# Altium project USB30HUB2V0.PrjPCB
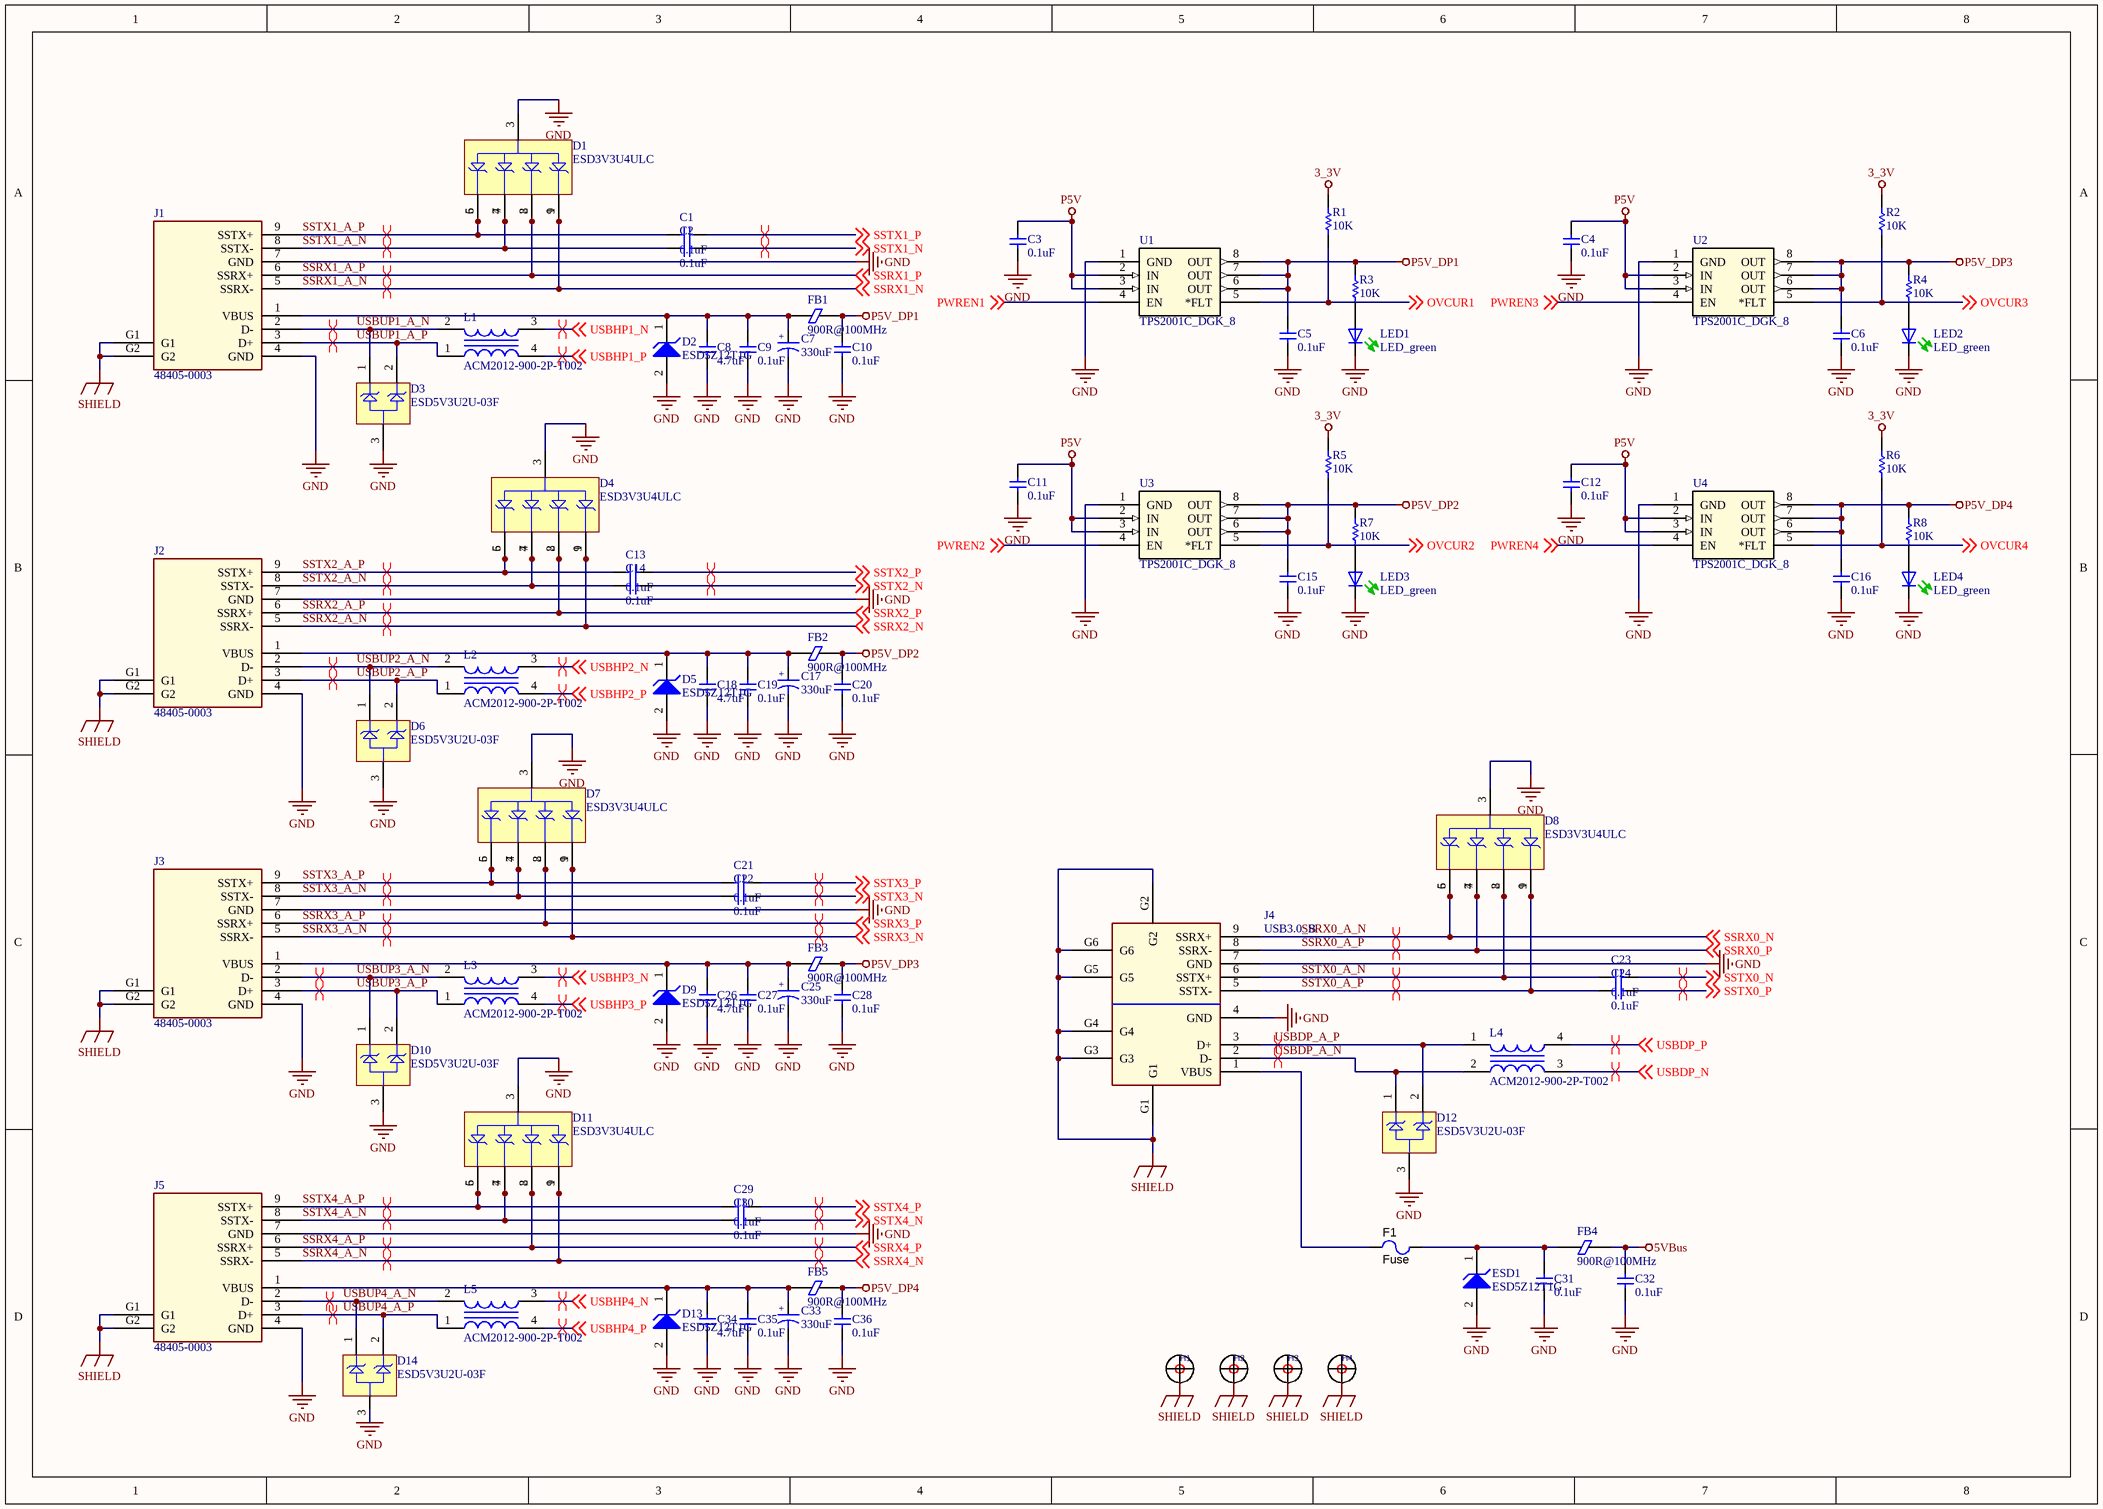
[diagram p0: TUSB8041_Connectors_2.SchDoc]
3 sheets, 193 parts. Net scope: global (net labels, ports and power ports of the same name join across sheets).
Board file: V1_2.PcbDoc
Sheets:
  TUSB8041_Connectors_2.SchDoc
  TUSB8041_Misc_2.SchDoc
  TUSB8041_Power_Logic_2.SchDoc

## Sheet TUSB8041_Connectors_2.SchDoc
size A3; SheetNumber: 1; SheetTotal: 3

### Parts
C1  0.1uF  [CAP0402]
C2  0.1uF  [CAP0402]
C3  0.1uF  [CAP0603]
C4  0.1uF  [CAP0603]
C5  0.1uF  [CAP0603]
C6  0.1uF  [CAP0603]
C7  330uF  [CAP7343_TANT]
C8  4.7uF  [CAP0603]
C9  0.1uF  [CAP0603]
C10  0.1uF  [CAP0603]
C11  0.1uF  [CAP0603]
C12  0.1uF  [CAP0603]
C13  0.1uF  [CAP0402]
C14  0.1uF  [CAP0402]
C15  0.1uF  [CAP0603]
C16  0.1uF  [CAP0603]
C17  330uF  [CAP7343_TANT]
C18  4.7uF  [CAP0603]
C19  0.1uF  [CAP0603]
C20  0.1uF  [CAP0603]
C21  0.1uF  [CAP0402]
C22  0.1uF  [CAP0402]
C23  0.1uF  [CAP0402]
C24  0.1uF  [CAP0402]
C25  330uF  [CAP7343_TANT]
C26  4.7uF  [CAP0603]
C27  0.1uF  [CAP0603]
C28  0.1uF  [CAP0603]
C29  0.1uF  [CAP0402]
C30  0.1uF  [CAP0402]
C31  0.1uF  [CAP0603]
C32  0.1uF  [CAP0603]
C33  330uF  [CAP7343_TANT]
C34  4.7uF  [CAP0603]
C35  0.1uF  [CAP0603]
C36  0.1uF  [CAP0603]
D1  ESD3V3U4ULC  [PG-TSLP-9-1]
D2  ESD5Z12T1G  [ONSC-SOD-523-2-502-01_V]
D3  ESD5V3U2U-03F  [INF-PG-TSFP-3-1_V]
D4  ESD3V3U4ULC  [PG-TSLP-9-1]
D5  ESD5Z12T1G  [ONSC-SOD-523-2-502-01_V]
D6  ESD5V3U2U-03F  [INF-PG-TSFP-3-1_V]
D7  ESD3V3U4ULC  [PG-TSLP-9-1]
D8  ESD3V3U4ULC  [PG-TSLP-9-1]
D9  ESD5Z12T1G  [ONSC-SOD-523-2-502-01_V]
D10  ESD5V3U2U-03F  [INF-PG-TSFP-3-1_V]
D11  ESD3V3U4ULC  [PG-TSLP-9-1]
D12  ESD5V3U2U-03F  [INF-PG-TSFP-3-1_V]
D13  ESD5Z12T1G  [ONSC-SOD-523-2-502-01_V]
D14  ESD5V3U2U-03F  [INF-PG-TSFP-3-1_V]
ESD1  ESD5Z12T1G  [ONSC-SOD-523-2-502-01_V]
F1  Fuse  [FUSE1206]
FB1  900R@100MHz  [L0805]
FB2  900R@100MHz  [L0805]
FB3  900R@100MHz  [L0805]
FB4  900R@100MHz  [L0805]
FB5  900R@100MHz  [L0805]
H1  HOLE  [HOLE_Φ3_1_2D]  (value not drawn)
H2  HOLE  [HOLE_Φ3_1_2D]  (value not drawn)
H3  HOLE  [HOLE_Φ3_1_2D]  (value not drawn)
H4  HOLE  [HOLE_Φ3_1_2D]  (value not drawn)
J1  48405-0003  [CN_USB30_A]
J2  48405-0003  [CN_USB30_A]
J3  48405-0003  [CN_USB30_A]
J4  USB3.0_B  [ASS_4224_CO]
J5  48405-0003  [CN_USB30_A]
L1  ACM2012-900-2P-T002  [TDK-ACM2012_V]
L2  ACM2012-900-2P-T002  [TDK-ACM2012_V]
L3  ACM2012-900-2P-T002  [TDK-ACM2012_V]
L4  ACM2012-900-2P-T002  [TDK-ACM2012_V]
L5  ACM2012-900-2P-T002  [TDK-ACM2012_V]
LED1  LED_green  [LED-0603-GREEN]
LED2  LED_green  [LED-0603-GREEN]
LED3  LED_green  [LED-0603-GREEN]
LED4  LED_green  [LED-0603-GREEN]
R1  10K  [RES0603]
R2  10K  [RES0603]
R3  10K  [RES0603]
R4  10K  [RES0603]
R5  10K  [RES0603]
R6  10K  [RES0603]
R7  10K  [RES0603]
R8  10K  [RES0603]
U1  TPS2001C_DGK_8  [VSSOP8]
U2  TPS2001C_DGK_8  [VSSOP8]
U3  TPS2001C_DGK_8  [VSSOP8]
U4  TPS2001C_DGK_8  [VSSOP8]

### Nets
3_3V: R1.1 R2.1 R5.1 R6.1
5VBus: C32.2 FB4.2
GND: C3.1 C4.1 C5.1 C6.1 C7.2 C8.1 C9.1 C10.1 C11.1 C12.1 C15.1 C16.1 C17.2 C18.1 C19.1 C20.1 C25.2 C26.1 C27.1 C28.1 C31.1 C32.1 C33.2 C34.1 C35.1 C36.1 D1.3(A) D2.2(A) D3.3(A) D4.3(A) D5.2(A) D6.3(A) D7.3(A) D8.3(A) D9.2(A) D10.3(A) D11.3(A) D12.3(A) D13.2(A) D14.3(A) ESD1.2(A) J1.4(GND) J1.7(GND) J2.4(GND) J2.7(GND) J3.4(GND) J3.7(GND) J4.4(GND) J4.7(GND) J5.4(GND) J5.7(GND) LED1.K(C) LED2.K(C) LED3.K(C) LED4.K(C) U1.1(GND) U2.1(GND) U3.1(GND) U4.1(GND)
P5V: C3.2 C4.2 C11.2 C12.2 U1.2(IN) U1.3(IN) U2.2(IN) U2.3(IN) U3.2(IN) U3.3(IN) U4.2(IN) U4.3(IN)
P5V_DP1: C5.2 C10.2 FB1.2 R3.1 U1.6(OUT) U1.7(OUT) U1.8(OUT)
P5V_DP2: C15.2 C20.2 FB2.2 R7.1 U3.6(OUT) U3.7(OUT) U3.8(OUT)
P5V_DP3: C6.2 C28.2 FB3.2 R4.1 U2.6(OUT) U2.7(OUT) U2.8(OUT)
P5V_DP4: C16.2 C36.2 FB5.2 R8.1 U4.6(OUT) U4.7(OUT) U4.8(OUT)
SHIELD: H1.1 H2.1 H3.1 H4.1 J1.G1 J1.G2 J2.G1 J2.G2 J3.G1 J3.G2 J4.G1 J4.G2 J4.G3 J4.G4 J4.G5 J4.G6 J5.G1 J5.G2
OVCUR1: R1.2 U1.5(*FLT) ; off-sheet OVCUR1
OVCUR2: R5.2 U3.5(*FLT) ; off-sheet OVCUR2
OVCUR3: R2.2 U2.5(*FLT) ; off-sheet OVCUR3
OVCUR4: R6.2 U4.5(*FLT) ; off-sheet OVCUR4
PWREN1: U1.4(EN) ; off-sheet PWREN1
PWREN2: U3.4(EN) ; off-sheet PWREN2
PWREN3: U2.4(EN) ; off-sheet PWREN3
PWREN4: U4.4(EN) ; off-sheet PWREN4
SSRX0_A_N: D8.5(K5) D8.6(K6) J4.9(SSRX+) ; off-sheet SSRX0_N  [also labelled SSRX0_N]
SSRX0_A_P: D8.4(K4) D8.7(K7) J4.8(SSRX-) ; off-sheet SSRX0_P  [also labelled SSRX0_P]
SSRX1_A_N: D1.1(K1) D1.9(K9) J1.5(SSRX-) ; off-sheet SSRX1_N  [also labelled SSRX1_N]
SSRX1_A_P: D1.2(K2) D1.8(K8) J1.6(SSRX+) ; off-sheet SSRX1_P  [also labelled SSRX1_P]
SSRX2_A_N: D4.1(K1) D4.9(K9) J2.5(SSRX-) ; off-sheet SSRX2_N  [also labelled SSRX2_N]
SSRX2_A_P: D4.2(K2) D4.8(K8) J2.6(SSRX+) ; off-sheet SSRX2_P  [also labelled SSRX2_P]
SSRX3_A_N: D7.1(K1) D7.9(K9) J3.5(SSRX-) ; off-sheet SSRX3_N  [also labelled SSRX3_N]
SSRX3_A_P: D7.2(K2) D7.8(K8) J3.6(SSRX+) ; off-sheet SSRX3_P  [also labelled SSRX3_P]
SSRX4_A_N: D11.1(K1) D11.9(K9) J5.5(SSRX-) ; off-sheet SSRX4_N  [also labelled SSRX4_N]
SSRX4_A_P: D11.2(K2) D11.8(K8) J5.6(SSRX+) ; off-sheet SSRX4_P  [also labelled SSRX4_P]
SSTX0_A_N: C23.2 D8.2(K2) D8.8(K8) J4.6(SSTX+)
SSTX0_A_P: C24.2 D8.1(K1) D8.9(K9) J4.5(SSTX-)
SSTX0_N: C23.1 ; off-sheet SSTX0_N
SSTX0_P: C24.1 ; off-sheet SSTX0_P
SSTX1_A_N: C2.2 D1.4(K4) D1.7(K7) J1.8(SSTX-)
SSTX1_A_P: C1.2 D1.5(K5) D1.6(K6) J1.9(SSTX+)
SSTX1_N: C2.1 ; off-sheet SSTX1_N
SSTX1_P: C1.1 ; off-sheet SSTX1_P
SSTX2_A_N: C14.2 D4.4(K4) D4.7(K7) J2.8(SSTX-)
SSTX2_A_P: C13.2 D4.5(K5) D4.6(K6) J2.9(SSTX+)
SSTX2_N: C14.1 ; off-sheet SSTX2_N
SSTX2_P: C13.1 ; off-sheet SSTX2_P
SSTX3_A_N: C22.2 D7.4(K4) D7.7(K7) J3.8(SSTX-)
SSTX3_A_P: C21.2 D7.5(K5) D7.6(K6) J3.9(SSTX+)
SSTX3_N: C22.1 ; off-sheet SSTX3_N
SSTX3_P: C21.1 ; off-sheet SSTX3_P
SSTX4_A_N: C30.2 D11.4(K4) D11.7(K7) J5.8(SSTX-)
SSTX4_A_P: C29.2 D11.5(K5) D11.6(K6) J5.9(SSTX+)
SSTX4_N: C30.1 ; off-sheet SSTX4_N
SSTX4_P: C29.1 ; off-sheet SSTX4_P
USBDP_A_N: D12.1(K1) J4.2(D-) L4.2
USBDP_A_P: D12.2(K2) J4.3(D+) L4.1
USBDP_N: L4.3 ; off-sheet USBDP_N
USBDP_P: L4.4 ; off-sheet USBDP_P
USBHP1_N: L1.3 ; off-sheet USBHP1_N
USBHP1_P: L1.4 ; off-sheet USBHP1_P
USBHP2_N: L2.3 ; off-sheet USBHP2_N
USBHP2_P: L2.4 ; off-sheet USBHP2_P
USBHP3_N: L3.3 ; off-sheet USBHP3_N
USBHP3_P: L3.4 ; off-sheet USBHP3_P
USBHP4_N: L5.3 ; off-sheet USBHP4_N
USBHP4_P: L5.4 ; off-sheet USBHP4_P
USBUP1_A_N: D3.1(K1) J1.2(D-) L1.2
USBUP1_A_P: D3.2(K2) J1.3(D+) L1.1
USBUP2_A_N: D6.1(K1) J2.2(D-) L2.2
USBUP2_A_P: D6.2(K2) J2.3(D+) L2.1
USBUP3_A_N: D10.1(K1) J3.2(D-) L3.2
USBUP3_A_P: D10.2(K2) J3.3(D+) L3.1
USBUP4_A_N: D14.1(K1) J5.2(D-) L5.2
USBUP4_A_P: D14.2(K2) J5.3(D+) L5.1
NetC7_1: C7.1 C8.2 C9.2 D2.1(K) FB1.1 J1.1(VBUS)
NetC17_1: C17.1 C18.2 C19.2 D5.1(K) FB2.1 J2.1(VBUS)
NetC25_1: C25.1 C26.2 C27.2 D9.1(K) FB3.1 J3.1(VBUS)
NetC31_2: C31.2 ESD1.1(K) F1.1 FB4.1
NetC33_1: C33.1 C34.2 C35.2 D13.1(K) FB5.1 J5.1(VBUS)
NetF1_2: F1.2 J4.1(VBUS)
NetLED1_A: LED1.A R3.2
NetLED2_A: LED2.A R4.2
NetLED3_A: LED3.A R7.2
NetLED4_A: LED4.A R8.2

### Layout directives
differential pair: SSRX0_A_N, SSRX0_A_P, SSRX1_A_N, SSRX1_A_P, SSRX2_A_N, SSRX2_A_P, SSRX3_A_N, SSRX3_A_P, SSRX4_A_N, SSRX4_A_P, SSTX0_A_N, SSTX0_A_P, SSTX0_N, SSTX0_P, SSTX1_A_N, SSTX1_A_P, SSTX1_N, SSTX1_P, SSTX2_A_N, SSTX2_A_P, SSTX2_N, SSTX2_P, SSTX3_A_N, SSTX3_A_P, SSTX3_N, SSTX3_P, SSTX4_A_N, SSTX4_A_P, SSTX4_N, SSTX4_P, USBDP_A_N, USBDP_A_P, USBDP_N, USBDP_P, USBHP1_N, USBHP1_P, USBHP2_N, USBHP2_P, USBHP3_N, USBHP3_P, USBHP4_N, USBHP4_P, USBUP1_A_N, USBUP1_A_P, USBUP2_A_N, USBUP2_A_P, USBUP3_A_N, USBUP3_A_P, USBUP4_A_N, USBUP4_A_P

### Notes on the sheet
- Title
- Size:
- Date:
- A3
- Number:
- Time:
- Revision:
- Sheet
- of
- File:
- (in symbol CAP_POL) +

### Library data of the parts
C1-C6 C8-C16 C18-C24 C26-C32 C34-C36 = CAP: Capacitor; Value: 104; Published: 8-Jun-2000; LatestRevisionDate: 17-Jul-2002; LatestRevisionNote: Re-released for DXP Platform.; PackageReference: RAD-0.3; Publisher: Altium Limited
C7 C17 C25 C33 = CAP_POL
D1 D4 D7 D8 D11 = ESD3V3U4ULC: Ultra-Low Capacitance ESD / Transient Protection Array, -40 to 125 degC, PG-TSLP-9-1, Reel, Green; Manufacturer: Infineon; VRWM (max): 3.3Â V; CL (typ): 0.4Â pF; CL (max): 0.65Â pF; Rdyn typ reverse: 0.19Â Ohm; IEFT: 50 A; IR (max): 50Â uA; Rdyn typ forward: 0.23Â Ohm; Protected Lines: 4; VESD (max): 20Â kV; Green: TRUE; Isurge: 3 A; PackageVersion: Mar-13; ComponentLink2Description: Datasheet; ComponentLink3Description: Package Specification; ComponentLink1Description: Manufacturer URL; DatasheetVersion: Rev. 1.2; Packing: Reel; PackageDescription: 9-Pin Thin Small Leadless Package, Body 2.3 x 1 mm, Pitch 0.5 mm; PackageReference: PG-TSLP-9-1; ComponentLink2URL: http://www.infineon.com/dgdl/ESD3V3U4ULC_rev_1_2_ESD_Transient_Protection_Diode_Infineon.pdf?folderId=db3a30431f848401011fcbf2ab4c04c4&fileId=db3a30433004641301300d2a08107ac6; ComponentLink3URL: http://www.infineon.com/dgdl/ESD3V3U4ULC_rev_1_2_ESD_Transient_Protection_Diode_Infineon.pdf?folderId=db3a30431f848401011fcbf2ab4c04c4&fileId=db3a30433004641301300d2a08107ac6; ComponentLink1URL: http://www.infineon.com/; Halogen-free: TRUE; PartNumber: ESD3V3U4ULC; Mounting Technology: Surface Mount
D2 D5 D9 D13 ESD1 = CMP-1063-00099-1: Transient Voltage Suppressor, Micro-Packaged Diode for ESD Protection, 2-Pin SOD-523, Pb-Free, Tape and Reel; Manufacturer: On Semiconductor; VRWM Max (V): 12; Number of Lines: 1; V(BR) Min (V): 14.1; Direction: Unidirectional; IR Max (uA): 0.01; PPK Max (W): 240; ComponentLink1URL: http://www.onsemi.com/; PartNumber: ESD5Z12T1G; RoHS: Pb-Free; ComponentLink3Description: Package Specification; PackageVersion: Rev. E, 09/2010; PackageReference: SOD-523-2-502-01; PackageDescription: 2-Pin SOD, Body 1.2 x 0.8 mm; ComponentLink2Description: Datasheet; ComponentLink1Description: Manufacturer URL; Mounting Technology: Surface Mount; DatasheetVersion: Rev. 10; ComponentLink3URL: http://www.onsemi.com/pub_link/Collateral/502-01.PDF; ComponentLink2URL: http://www.onsemi.cn/pub_link/Collateral/ESD5Z2.5T1-D.PDF; Packing: Tape and Reel
D3 D6 D10 D12 D14 = CMP-1150-00002-1: Ultra-Low Capacitance ESD Diode Array, -40 to 125 degC, PG-TSFP-3-1, Reel, Green; Manufacturer: Infineon; Rdyn typ reverse: 0.6Â Ohm; Rdyn typ forward: 0.5Â Ohm; VRWM (max): 5.3Â V; IR (max): 50Â uA; CL (typ): 0.4Â pF; IEFT: 40 A; VESD (max): 20Â kV; Isurge: 3 A; CL (max): 0.6Â pF; Green: TRUE; Protected Lines: 2; ComponentLink3URL: http://www.infineon.com/dgdl/TSFP-3-1%2C-2-Package_Overview.pdf?folderId=db3a30431936bc4b0119538cdcb03d2d&fileId=db3a30431936bc4b0119539929863d46; PartNumber: ESD5V3U2U-03F; ComponentLink3Description: Package Specification; ComponentLink2Description: Datasheet; ComponentLink2URL: http://www.infineon.com/dgdl/esd5v3u2useries.pdf?folderId=db3a30431441fb5d011488a9e66f0ded&fileId=db3a30431b0626df011b0d3e3ca97dc0; PackageReference: PG-TSFP-3-1; ComponentLink1URL: http://www.infineon.com/; Mounting Technology: Surface Mount; ComponentLink1Description: Manufacturer URL; PackageVersion: Apr-08; Halogen-free: TRUE; Packing: Reel; PackageDescription: 3-Pin Thin Small Flat Package, Body 1.2 x 0.8 mm, Pitch 0.4 mm
F1 = Fuse: PartNumber: NANOSMDC020F-2; Manufacturer: TE Connectivity; VDC_V: 24; Rtyp_Ohm: 1.875; SymbolCreator: a0412235; SymbolVersion: 2013-04-02; PackageReference: 1206; MountType: SMT; CompType: Fuse; RoHS: Y; Published: 2009-03-05; Publisher: Texas Instruments; LatestRevisionDate: 2015-11-23; ComponentLink1Description: Datasheet URL; ComponentLink1URL: http://www.te.com/commerce/DocumentDelivery/DDEController?Action=srchrtrv&DocNm=SCD25536&DocType=Customer+Drawing&DocLang=English; Supplier 1: Digi-Key; Supplier Part Number 1: NANOSMDC020F-2CT-ND; Supplier 2: Mouser; Supplier Part Number 2: 650-NANOSMDC020F-2; Supplier 3: Farnell; Supplier Part Number 3: 1345939
FB1-FB5 = Ferrite Bead
H1-H4 = HOLE: CLASS: IC; CAD_APPROVED: Yes; MFG_PN01: TP-105-01-09; MFG_NAME01: COMPONENTS CORPORATION; AGILE_PN: 210-75685; HEIGHT: 4.8 MM; ROHS: Yes
J1-J3 J5 = USB-UEA11123-4HK1-4H: Date: 02042009
L1-L5 = CMP-2000-05738-1: Common Mode Filter, 90 Ohm, 50 V, -40 to 85 degC, 4-Pin SMD, RoHS, Tape and Reel; Manufacturer: TDKCorporation; Test Frequency: 100MHz; Configuration: Dual; Maximum DC Resistance: 190mOhm; Product Depth: 1.4mm; Product Height: 1.3mm; Voltage Rating: 50VDC; Impedance: 90Ohm; Product Length: 2.2mm; Number of Lines: 2; Maximum DC Current: 400mA; Type: SignalLine; Maximum Operating Temperature: 85C; Minimum Operating Temperature: -40C; Part No: ACM2012-900-2P-T; Datasheet Version: 12/2015; Family: ACM; RoHS: Yes; Inductance: N/A; Manufacturer URL: http://www.tdk.com/; Mounting Technology: SurfaceMount; Package Description: 4-Pin Surface Mounted Device, Body 2 x 1.2 mm, Pitch 0.8 mm; Attenuation: N/A; Package Reference: ACM2012; Packaging: TapeandReel; Minimum Insulation Resistance: N/A; Withstand Voltage: N/A; Leakage Inductance: N/A; Datasheet URL: https://product.tdk.com/info/en/catalog/datasheets/cmf_commercial_signal_acm2012_en.pdf
R1-R8 = RES: Resistor; Value: 1K; Published: 8-Jun-2000; Revision: July-2002: Re-released for DXP Platform.; Publisher: Altium Limited
U1-U4 = TPS2001C_DGK_8: 2A_MOS_PSW; Vendor: Texas Instruments; PACKAGE_DESIGNATOR: DGK; PIN_COUNT: 8; FAMILY_NAME: USB POWER SWITCH; INDUSTRY_STD_PKG_TYPE: MSOP; Manufacturer_Part_Number: tps2001c_dgk_8; GENERIC_PART_NUMBER: TPS2001C; Datasheet URL: http://www.ti.com/lit/gpn/TPS2001C; Manufacturer: Texas Instruments; RefDes: RefDes; Type: Type; Value: Value
J4 = USB3.0_B: Date: 02042009

## Sheet TUSB8041_Misc_2.SchDoc
size 386 x 246 mm; SheetNumber: 2; SheetTotal: 3
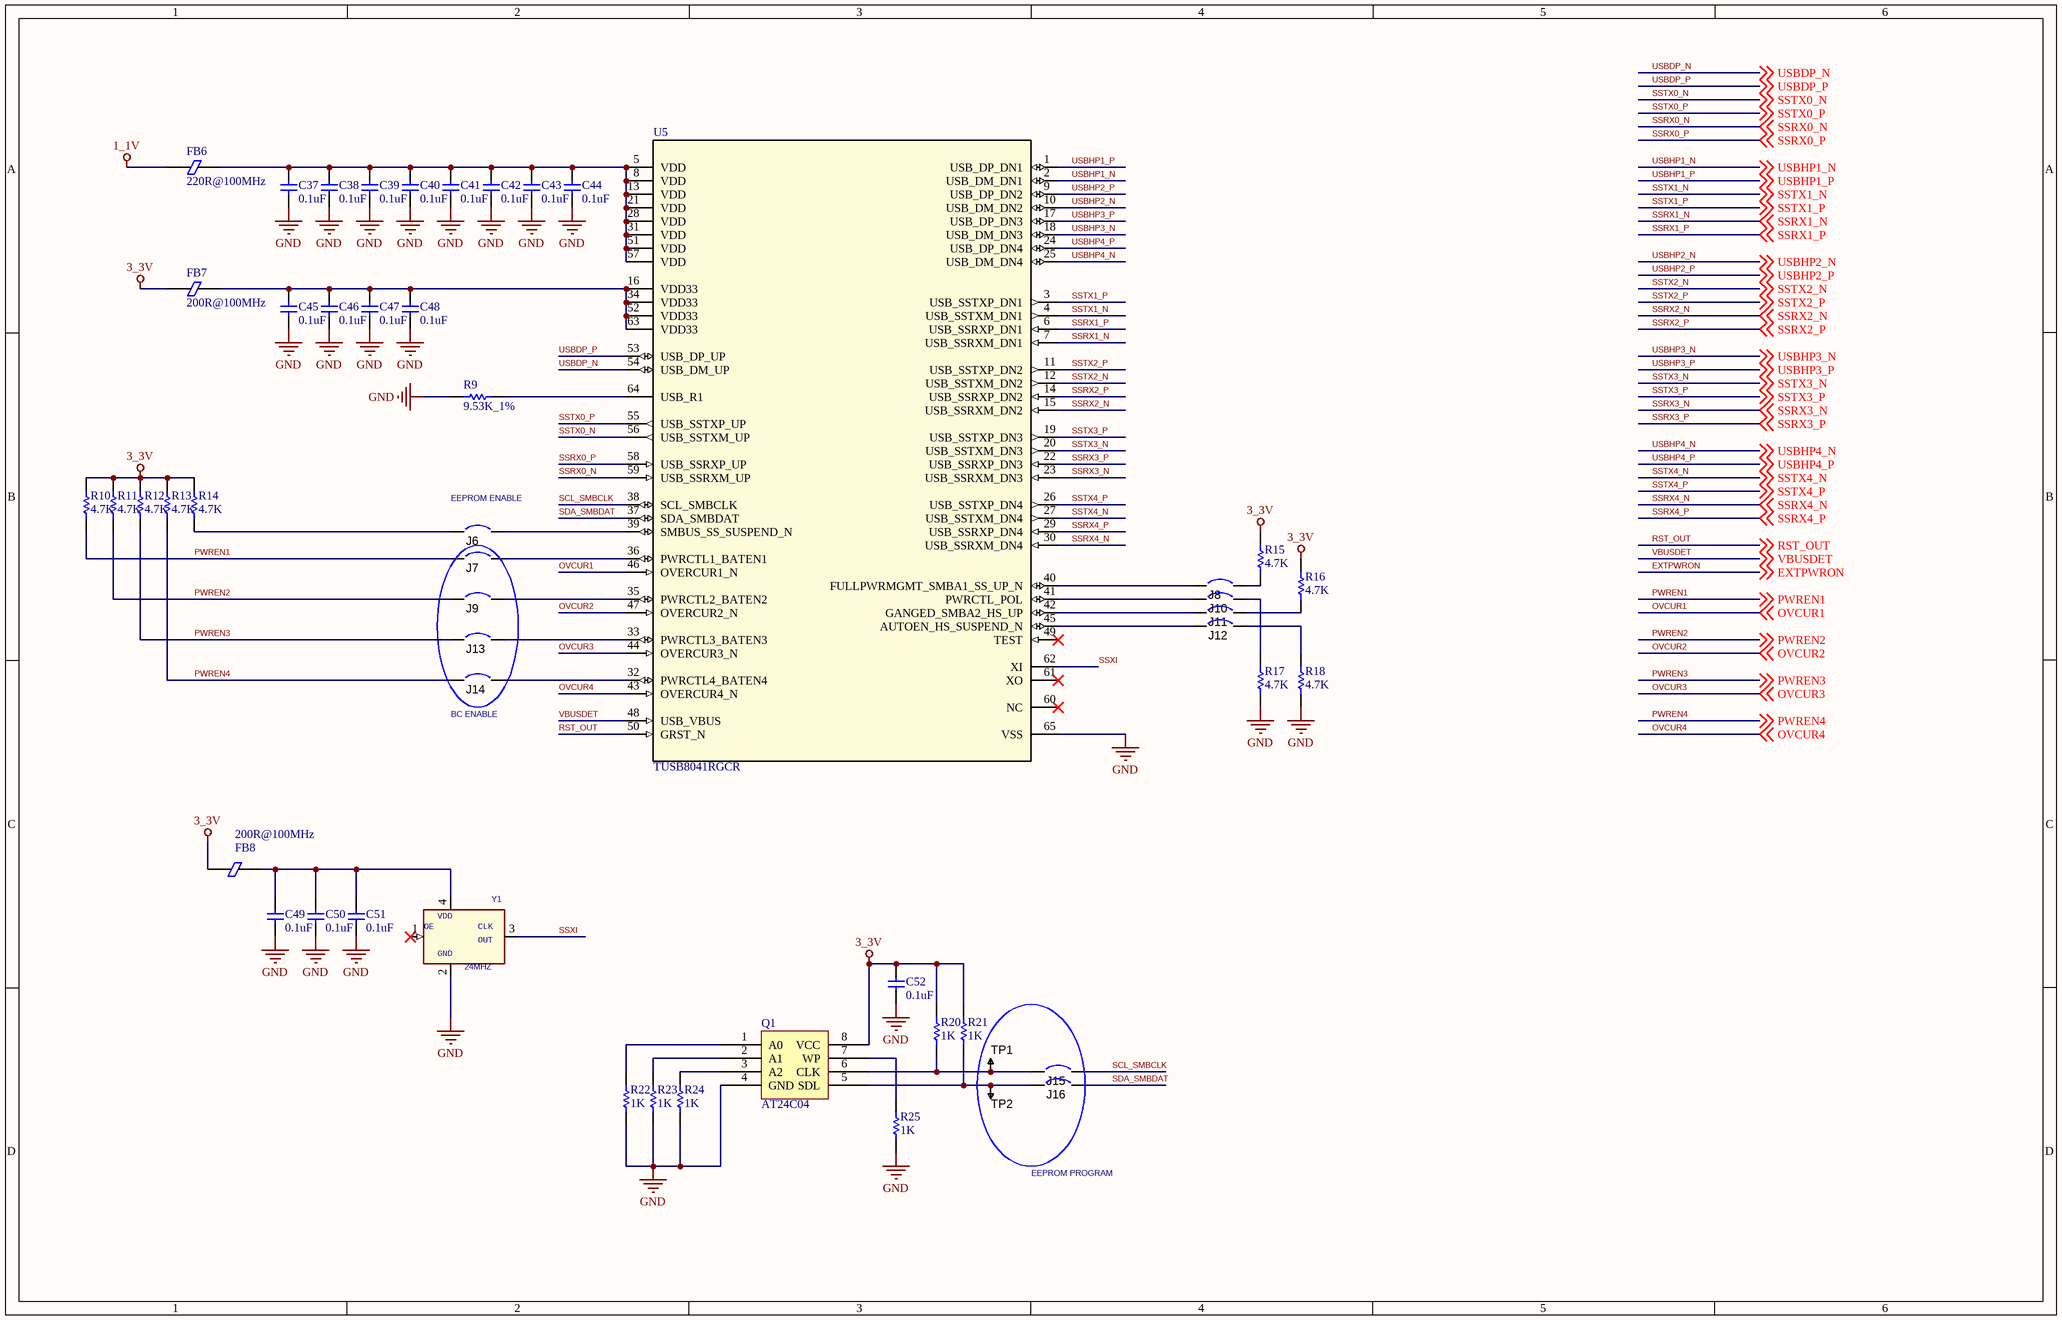
[diagram p1: TUSB8041_Misc_2.SchDoc]

### Parts
C37  0.1uF  [CAP0402]
C38  0.1uF  [CAP0402]
C39  0.1uF  [CAP0402]
C40  0.1uF  [CAP0402]
C41  0.1uF  [CAP0402]
C42  0.1uF  [CAP0402]
C43  0.1uF  [CAP0402]
C44  0.1uF  [CAP0402]
C45  0.1uF  [CAP0402]
C46  0.1uF  [CAP0402]
C47  0.1uF  [CAP0402]
C48  0.1uF  [CAP0402]
C49  0.1uF  [CAP0603]
C50  0.1uF  [CAP0603]
C51  0.1uF  [CAP0603]
C52  0.1uF  [CAP0603]
FB6  220R@100MHz  [L0603]
FB7  200R@100MHz  [L0603]
FB8  200R@100MHz  [L0603]
J6  JUMPER  [JP]  (value not drawn)
J7  JUMPER  [JP]  (value not drawn)
J8  JUMPER  [JP]  (value not drawn)
J9  JUMPER  [JP]  (value not drawn)
J10  JUMPER  [JP]  (value not drawn)
J11  JUMPER  [JP]  (value not drawn)
J12  JUMPER  [JP]  (value not drawn)
J13  JUMPER  [JP]  (value not drawn)
J14  JUMPER  [JP]  (value not drawn)
J15  JUMPER  [JP]  (value not drawn)
J16  JUMPER  [JP]  (value not drawn)
Q1  AT24C04  [SOIC-8]
R9  9.53K_1%  [RES0603]
R10  4.7K  [RES0603]
R11  4.7K  [RES0603]
R12  4.7K  [RES0603]
R13  4.7K  [RES0603]
R14  4.7K  [RES0603]
R15  4.7K  [RES0603]
R16  4.7K  [RES0603]
R17  4.7K  [RES0603]
R18  4.7K  [RES0603]
R20  1K  [RES0603]
R21  1K  [RES0603]
R22  1K  [RES0603]
R23  1K  [RES0603]
R24  1K  [RES0603]
R25  1K  [RES0603]
TP1  TESTPOINT_THT_MINI  [TP]  (value not drawn)
TP2  TESTPOINT_THT_MINI  [TP]  (value not drawn)
U5  TUSB8041RGCR  [QFN64_9*9]
Y1  24MHZ  [XTAL-3225]

### Nets
1_1V: FB6.2
3_3V: C52.2 FB7.2 FB8.2 Q1.8(VCC) R10.2 R11.2 R12.2 R13.2 R14.2 R15.2 R16.2 R20.2 R21.2
GND: C37.1 C38.1 C39.1 C40.1 C41.1 C42.1 C43.1 C44.1 C45.1 C46.1 C47.1 C48.1 C49.1 C50.1 C51.1 C52.1 Q1.4(GND) R9.2 R17.1 R18.1 R22.1 R23.1 R24.1 R25.1 U5.65(VSS) Y1.2(GND)
OVCUR1: U5.46(OVERCUR1_N) ; off-sheet OVCUR1
OVCUR2: U5.47(OVERCUR2_N) ; off-sheet OVCUR2
OVCUR3: U5.44(OVERCUR3_N) ; off-sheet OVCUR3
OVCUR4: U5.43(OVERCUR4_N) ; off-sheet OVCUR4
PWREN1: J7.1 R10.1 ; off-sheet PWREN1
PWREN2: J9.1 R11.1 ; off-sheet PWREN2
PWREN3: J13.1 R12.1 ; off-sheet PWREN3
PWREN4: J14.1 R13.1 ; off-sheet PWREN4
RST_OUT: U5.50(GRST_N) ; off-sheet RST_OUT
SCL_SMBCLK: J15.2 U5.38(SCL_SMBCLK)
SDA_SMBDAT: J16.2 U5.37(SDA_SMBDAT)
SSRX0_N: U5.59(USB_SSRXM_UP) ; off-sheet SSRX0_N  [project net SSRX0_A_N]
SSRX0_P: U5.58(USB_SSRXP_UP) ; off-sheet SSRX0_P  [project net SSRX0_A_P]
SSRX1_N: U5.7(USB_SSRXM_DN1) ; off-sheet SSRX1_N  [project net SSRX1_A_N]
SSRX1_P: U5.6(USB_SSRXP_DN1) ; off-sheet SSRX1_P  [project net SSRX1_A_P]
SSRX2_N: U5.15(USB_SSRXM_DN2) ; off-sheet SSRX2_N  [project net SSRX2_A_N]
SSRX2_P: U5.14(USB_SSRXP_DN2) ; off-sheet SSRX2_P  [project net SSRX2_A_P]
SSRX3_N: U5.23(USB_SSRXM_DN3) ; off-sheet SSRX3_N  [project net SSRX3_A_N]
SSRX3_P: U5.22(USB_SSRXP_DN3) ; off-sheet SSRX3_P  [project net SSRX3_A_P]
SSRX4_N: U5.30(USB_SSRXM_DN4) ; off-sheet SSRX4_N  [project net SSRX4_A_N]
SSRX4_P: U5.29(USB_SSRXP_DN4) ; off-sheet SSRX4_P  [project net SSRX4_A_P]
SSTX0_N: U5.56(USB_SSTXM_UP) ; off-sheet SSTX0_N
SSTX0_P: U5.55(USB_SSTXP_UP) ; off-sheet SSTX0_P
SSTX1_N: U5.4(USB_SSTXM_DN1) ; off-sheet SSTX1_N
SSTX1_P: U5.3(USB_SSTXP_DN1) ; off-sheet SSTX1_P
SSTX2_N: U5.12(USB_SSTXM_DN2) ; off-sheet SSTX2_N
SSTX2_P: U5.11(USB_SSTXP_DN2) ; off-sheet SSTX2_P
SSTX3_N: U5.20(USB_SSTXM_DN3) ; off-sheet SSTX3_N
SSTX3_P: U5.19(USB_SSTXP_DN3) ; off-sheet SSTX3_P
SSTX4_N: U5.27(USB_SSTXM_DN4) ; off-sheet SSTX4_N
SSTX4_P: U5.26(USB_SSTXP_DN4) ; off-sheet SSTX4_P
SSXI: U5.62(XI) Y1.3(CLKOUT)
USBDP_N: U5.54(USB_DM_UP) ; off-sheet USBDP_N
USBDP_P: U5.53(USB_DP_UP) ; off-sheet USBDP_P
USBHP1_N: U5.2(USB_DM_DN1) ; off-sheet USBHP1_N
USBHP1_P: U5.1(USB_DP_DN1) ; off-sheet USBHP1_P
USBHP2_N: U5.10(USB_DM_DN2) ; off-sheet USBHP2_N
USBHP2_P: U5.9(USB_DP_DN2) ; off-sheet USBHP2_P
USBHP3_N: U5.18(USB_DM_DN3) ; off-sheet USBHP3_N
USBHP3_P: U5.17(USB_DP_DN3) ; off-sheet USBHP3_P
USBHP4_N: U5.25(USB_DM_DN4) ; off-sheet USBHP4_N
USBHP4_P: U5.24(USB_DP_DN4) ; off-sheet USBHP4_P
VBUSDET: U5.48(USB_VBUS) ; off-sheet VBUSDET
NetC37_2: C37.2 C38.2 C39.2 C40.2 C41.2 C42.2 C43.2 C44.2 FB6.1 U5.5(VDD) U5.8(VDD) U5.13(VDD) U5.21(VDD) U5.28(VDD) U5.31(VDD) U5.51(VDD) U5.57(VDD)
NetC45_2: C45.2 C46.2 C47.2 C48.2 FB7.1 U5.16(VDD33) U5.34(VDD33) U5.52(VDD33) U5.63(VDD33)
NetC49_2: C49.2 C50.2 C51.2 FB8.1 Y1.4(VDD)
NetJ6_1: J6.1 R14.1
NetJ6_2: J6.2 U5.39(SMBUS_SS_SUSPEND_N)
NetJ7_2: J7.2 U5.36(PWRCTL1_BATEN1)
NetJ8_1: J8.1 U5.40(FULLPWRMGMT_SMBA1_SS_UP_N)
NetJ8_2: J8.2 R15.1
NetJ9_2: J9.2 U5.35(PWRCTL2_BATEN2)
NetJ10_1: J10.1 U5.41(PWRCTL_POL)
NetJ10_2: J10.2 R17.2
NetJ11_1: J11.1 U5.42(GANGED_SMBA2_HS_UP)
NetJ11_2: J11.2 R16.1
NetJ12_1: J12.1 U5.45(AUTOEN_HS_SUSPEND_N)
NetJ12_2: J12.2 R18.2
NetJ13_2: J13.2 U5.33(PWRCTL3_BATEN3)
NetJ14_2: J14.2 U5.32(PWRCTL4_BATEN4)
NetJ15_1: J15.1 Q1.6(CLK) R20.1 TP1.1
NetJ16_1: J16.1 Q1.5(SDL) R21.1 TP2.1
NetQ1_1: Q1.1(A0) R22.2
NetQ1_2: Q1.2(A1) R23.2
NetQ1_3: Q1.3(A2) R24.2
NetQ1_7: Q1.7(WP) R25.2
NetR9_1: R9.1 U5.64(USB_R1)

Not connected (* = marked no-connect by the designer): U5 49(TEST)* 60(NC)* 61(XO)*; Y1 1(OE)*

### Notes on the sheet
- (near J6) EEPROM ENABLE
- (near J14) BC ENABLE
- EEPROM PROGRAM
- (in symbol XTAL) CLK; OUT

### Library data of the parts
C37-C52 = CAP: Capacitor; Value: 104; Published: 8-Jun-2000; LatestRevisionDate: 17-Jul-2002; LatestRevisionNote: Re-released for DXP Platform.; PackageReference: RAD-0.3; Publisher: Altium Limited
FB6-FB8 = Ferrite Bead
J6-J16 = JUMPER: Manufacturer: Used in BOM report; SymbolVersion: use current date i.e. 2008-05-20; SymbolCreator: Use a-id; CompType: Used in some BOM reports.  Useful for finding later.; U/M: EA, IN, or GM; MountType: SMT, TH, or N/A; RoHS: Used in BOM report.  Use Y or N.; PartNumber: Used in BOM report; PackageReference: N/A; ComponentLink1Description: Datasheet Link; Alternate PartNumber: -; Alternate Manufacturer: -
Q1 = AT24C04: I2C-Compatible, (2-wire) Serial EEPROM / 4-Kbit (512 x 8)
R9-R18 = RES: Resistor; Value: 1K; Published: 8-Jun-2000; Revision: July-2002: Re-released for DXP Platform.; Publisher: Altium Limited
R20-R25 = RES: Resistor; Published: 8-Jun-2000; Revision: July-2002: Re-released for DXP Platform.; Publisher: Altium Limited; Value: 1K
TP1 TP2 = TESTPOINT_THT_MINI: Test Point; Manufacturer 1: Keystone Electronics; Manufacturer Part Number 1: 5002; Mounting Type: 0.040" (1.0mm) Hole Diameter; Material: Base, Nylon 46, UL 94V-0; Supplier 1: Digi-Key; Supplier Part Number 1: 5002K-ND
U5 = TUSB8041RGCR: USB30HUB; Alternate PartNumber: TUSB8041RGCT; Manufacturer: Texas Instruments; CompType: IC; PIN_COUNT: 65; Application_BuildNumber: *; PartNumber: TUSB8041RGCR; PackageReference: RGC0064G; MountType: SMT; RoHS: Y; RefDes: RefDes; Type: TYPE; Value: Value
Y1 = XTAL: OSC 50MHZ FIXED 3.3V SMT; CLASS: IC; CAD_APPROVED: Yes; MFG_PN01: ECS-3953M-500-BN; MFG_NAME01: ECS INC. INTERNATIONAL; AGILE_PN: 230-76894; HEIGHT: 1.75MM; ROHS: Yes

## Sheet TUSB8041_Power_Logic_2.SchDoc
size A4; SheetNumber: 3; SheetTotal: 3
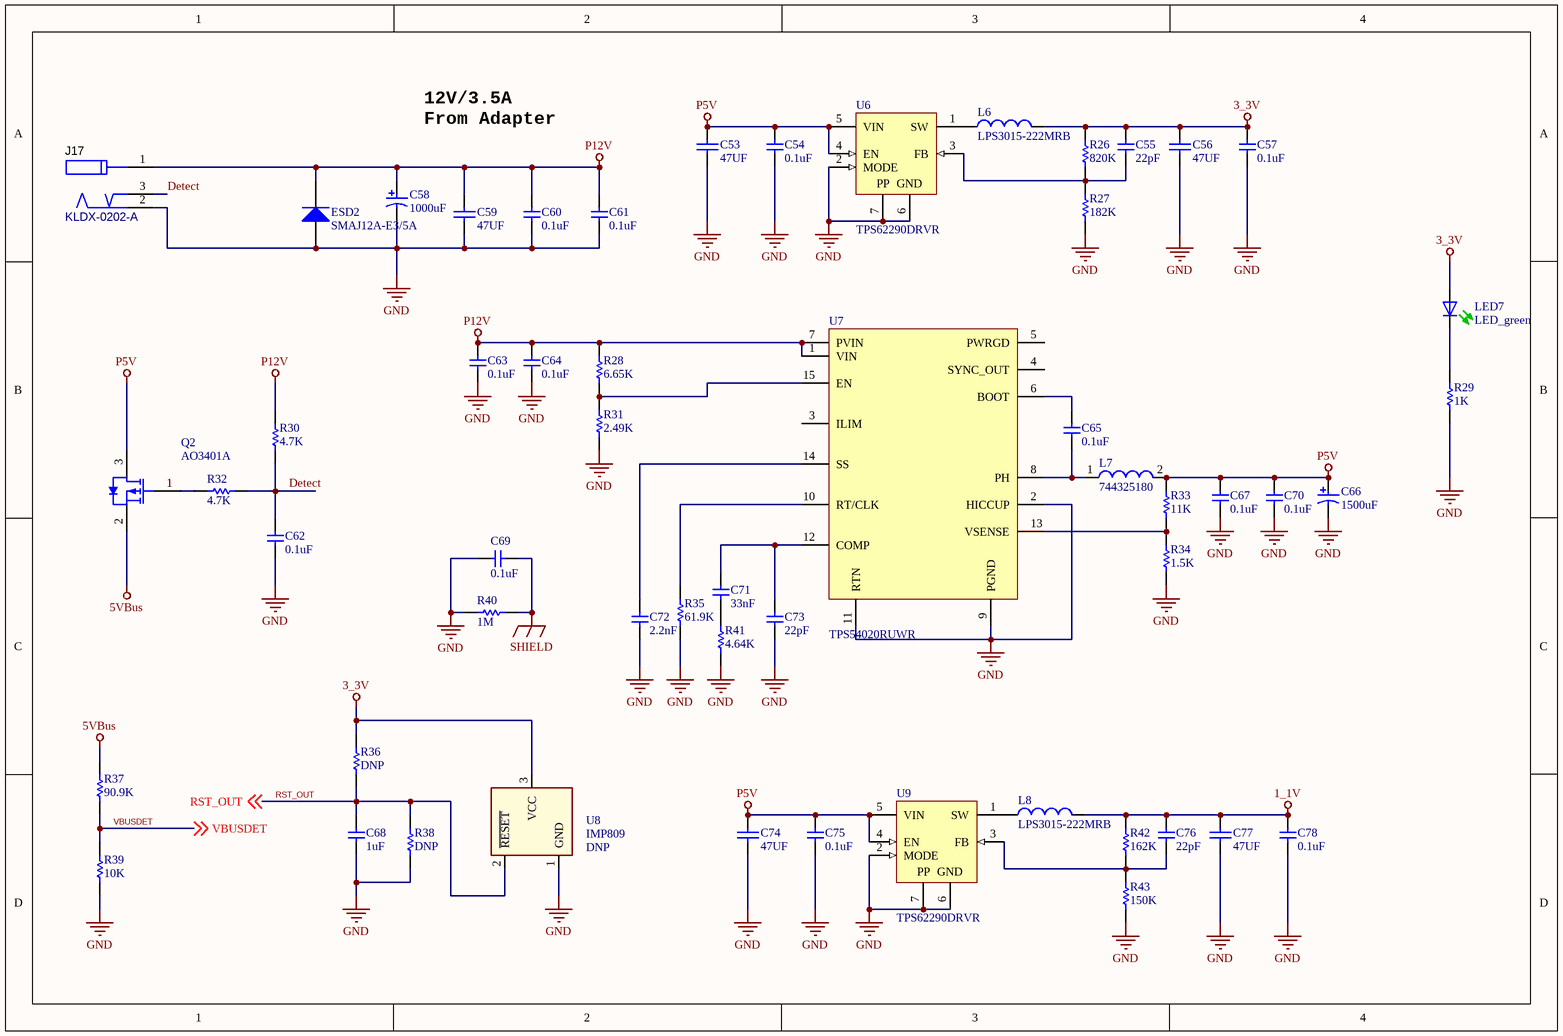
[diagram p2: TUSB8041_Power_Logic_2.SchDoc]

### Parts
C53  47UF  [CAPC1210(3225)200_L]
C54  0.1uF  [CAP0603]
C55  22pF  [CAP0603]
C56  47UF  [CAPC1210(3225)200_L]
C57  0.1uF  [CAP0603]
C58  1000uF  [NIC-UVR-10x12.5-2_V]
C59  47UF  [CAPC1210(3225)200_L]
C60  0.1uF  [CAP0603]
C61  0.1uF  [CAP0603]
C62  0.1uF  [CAP0603]
C63  0.1uF  [CAP0805]
C64  0.1uF  [CAP0603]
C65  0.1uF  [CAP0603]
C66  1500uF  [NIC-UVR-10x12.5-2_V]
C67  0.1uF  [CAP0805]
C68  1uF  [CAP0603]
C69  0.1uF  [CAP0603]
C70  0.1uF  [CAP0603]
C71  33nF  [CAP0603]
C72  2.2nF  [CAP0603]
C73  22pF  [CAP0603]
C74  47UF  [CAPC1210(3225)200_L]
C75  0.1uF  [CAP0603]
C76  22pF  [CAP0603]
C77  47UF  [CAPC1210(3225)200_L]
C78  0.1uF  [CAP0603]
ESD2  SMAJ12A-E3/5A  [VISH-DO-214AC-2_M]
J17  KLDX-0202-A  [KYCN-KLDX-0202-A_V]
L6  LPS3015-222MRB  [COIL-LPS3015_V]
L7  744325180  [WE-HCI-1050]
L8  LPS3015-222MRB  [COIL-LPS3015_V]
LED7  LED_green  [LED-0603-GREEN]
Q2  AO3401A  [AO-SOT-23-3L_V]
R26  820K  [RES0603]
R27  182K  [RES0603]
R28  6.65K  [RES0603]
R29  1K  [RES0603]
R30  4.7K  [RES0603]
R31  2.49K  [RES0603]
R32  4.7K  [RES0603]
R33  11K  [RES0603]
R34  1.5K  [RES0603]
R35  61.9K  [RES0603]
R36  DNP  [RES0603]
R37  90.9K  [RES0603]
R38  DNP  [RES0603]
R39  10K  [RES0603]
R40  1M  [RES0805]
R41  4.64K  [RES0603]
R42  162K  [RES0603]
R43  150K  [RES0603]
U6  TPS62290DRVR  [DRV6-1600X1000TP]
U7  TPS54020RUWR  [R-PVQFN-N15]
U8  IMP809  Parameter 1: DNP  [SOT23]
U9  TPS62290DRVR  [DRV6-1600X1000TP]

### Nets
1_1V: C76.2 C77.2 C78.2 L8.2 R42.1
3_3V: C55.2 C56.2 C57.2 L6.2 LED7.A R26.1 R36.1 U8.3(VCC)
5VBus: Q2.2(SOURCE) R37.1
GND: C53.1 C54.1 C56.1 C57.1 C58.2 C59.1 C60.1 C61.1 C62.1 C63.1 C64.1 C66.2 C67.1 C68.1 C69.2 C70.1 C72.1 C73.1 C74.1 C75.1 C77.1 C78.1 ESD2.2(A) J17.2 R27.2 R29.1 R31.2 R34.2 R35.2 R38.2 R39.2 R40.1 R41.2 R43.2 U6.2(MODE) U6.6(GND) U6.7(PP) U7.2(HICCUP) U7.9(PGND) U7.11(RTN) U8.1(GND) U9.2(MODE) U9.6(GND) U9.7(PP)
P5V: C53.2 C54.2 C66.1 C67.2 C70.2 C74.2 C75.2 L7.2 Q2.3(DRAIN) R33.1 U6.4(EN) U6.5(VIN) U9.4(EN) U9.5(VIN)
P12V: C58.1 C59.2 C60.2 C61.2 C63.2 C64.2 ESD2.1(K) J17.1 R28.1 R30.1 U7.1(VIN) U7.7(PVIN)
SHIELD: C69.1 R40.2
Detect: C62.2 J17.3 R30.2 R32.2
RST_OUT: C68.2 R36.2 R38.1 U8.2(~{RESET}) ; off-sheet RST_OUT
VBUSDET: R37.2 R39.1 ; off-sheet VBUSDET
NetC55_1: C55.1 R26.2 R27.1 U6.3(FB)
NetC65_1: C65.1 L7.1 U7.8(PH)
NetC65_2: C65.2 U7.6(BOOT)
NetC71_1: C71.1 R41.1
NetC71_2: C71.2 C73.2 U7.12(COMP)
NetC72_2: C72.2 U7.14(SS)
NetC76_1: C76.1 R42.2 R43.1 U9.3(FB)
NetL6_1: L6.1 U6.1(SW)
NetL8_1: L8.1 U9.1(SW)
NetLED7_K: LED7.K(C) R29.2
NetQ2_1: Q2.1(GATE) R32.1
NetR28_2: R28.2 R31.1 U7.15(EN)
NetR33_2: R33.2 R34.1 U7.13(VSENSE)
NetR35_1: R35.1 U7.10(RT/CLK)

Not connected (* = marked no-connect by the designer): U7 3(ILIM) 4(SYNC_OUT) 5(PWRGD)

### Notes on the sheet
- 12V/3.5A
  From Adapter

### Library data of the parts
C53 C56 C59 C74 C77 = CAP_5_2: 1210 (3225 Metric) Chip Capacitor; Case-EIA: 1210; Case-Metric: 3225; PackageReference: CAPC1210(3225)200
C54 C55 C57 C60-C65 C67-C73 C75 C76 C78 = CAP: Capacitor; Value: 104; Published: 8-Jun-2000; LatestRevisionDate: 17-Jul-2002; LatestRevisionNote: Re-released for DXP Platform.; PackageReference: RAD-0.3; Publisher: Altium Limited
C58 = CMP-1217-00001-1: Aluminum Electrolytic Capacitor, 63 V, -40 to 85 degC, 2-Pin CAP, RoHS; Manufacturer: Nichicon; PartNumber: UVR1J101MPD1TD; Capacitance Tolerance: +/-20%; Rated Voltage: 63 V; Packing: Bulk; Rated Ripple@85 degC 120 Hz: 300 mA; Rated Capacitance: 100 uF; ComponentLink3URL: http://nichicon-us.com/english/products/pdfs/e-vr.pdf; ComponentLink2Description: Datasheet; Operating Temperature: -40 to 85 degC; PackageDescription: 2-Pin Through Hole Package, Dia 10 mm, Body Length 12.5 mm, Pitch 5 mm; Mounting Technology: Through Hole; ComponentLink3Description: Package Specification; RoHS: TRUE; DatasheetVersion: Sep-13; ComponentLink1Description: Manufacturer URL; ComponentLink2URL: http://nichicon-us.com/english/products/pdfs/e-vr.pdf; ComponentLink1URL: http://www.nichicon.co.jp/
C66 = CMP-1217-00001-1: Aluminum Electrolytic Capacitor, 6.3 V, -40 to 85 degC, 2-Pin CAP, RoHS; Manufacturer: Nichicon; PartNumber: UVR1J101MPD1TD; Capacitance Tolerance: +/-20%; Rated Voltage: 63 V; Packing: Bulk; Rated Ripple@85 degC 120 Hz: 300 mA; Rated Capacitance: 100 uF; ComponentLink3URL: http://nichicon-us.com/english/products/pdfs/e-vr.pdf; ComponentLink2Description: Datasheet; Operating Temperature: -40 to 85 degC; PackageDescription: 2-Pin Through Hole Package, Dia 10 mm, Body Length 12.5 mm, Pitch 5 mm; Mounting Technology: Through Hole; ComponentLink3Description: Package Specification; RoHS: TRUE; DatasheetVersion: Sep-13; ComponentLink1Description: Manufacturer URL; ComponentLink2URL: http://nichicon-us.com/english/products/pdfs/e-vr.pdf; ComponentLink1URL: http://www.nichicon.co.jp/
ESD2 = CMP-0548-00315-2: Transient Voltage Suppressor, 6.40 to 231 V, 12 V Stand-off Voltage, Uni-Directional, -55 to 155 degC, 2-pin DO-214AC, Pb-Free, Tape and Reel; Manufacturer: Vishay Semiconductor; IFSM: 40 A; ID (uA): 1; VBR Uni-Directional (V): 6.4 to 231; PPPM (W): 400, 300; VWM (V): 12; PartNumber: SMAJ12A-E3/5A; ComponentLink2URL: http://www.vishay.com/docs/88390/smaj50a.pdf; Packing: Tape and Reel; DatasheetVersion: 12/8/2013; Operating Junction and Storage Temperature Range: -55 to 150 degC; Mounting Technology: Surface Mount; PackageDescription: 2-Pin DO-214AC (SMA), Body 4.245 x 2.665 mm; ComponentLink1URL: http://www.vishay.com/; ComponentLink3Description: Package Specification; PackageReference: DO-214AC-2; ComponentLink1Description: Manufacturer URL; ComponentLink2Description: Datasheet; RoHS: TRUE; ComponentLink3URL: http://www.vishay.com/docs/88390/smaj50a.pdf
J17 = CMP-1673-00001-1: DC Power Connectors 2mm PCB JACK POWER JACK; ComponentLink1URL: http://www.mouser.com/ds/2/222/KLDX_0202_LT-334784.pdf; ComponentLink1Description: Datasheet; PackageReference: KLDX-0202-A; PartNumber: KLDX-0202-A
L6 L8 = CMP-2000-06574-1: Shielded Power Inductor, 2.2 uH, +/- 20%, 110 mOhm, -40 to 85 degC, 2-Pin SMD, RoHS, Tape and Reel; Core Material: Ferrite; Qualification: AEC-Q200; Unit Weight: 0.001411oz; Maximum DC Resistance: 110mOhms; Maximum DC Current: 2.1A; Brand: Coilcraft; Test Frequency: 100kHz; Self Resonant Frequency: 110MHz; Inductance: 2.2uH; Width: 3mm; Datasheet URL: http://www.coilcraft.com/pdfs/lps3015.pdf; Series: LPS3015; Termination Style: SMD/SMT; Length: 3mm; Height: 1.4mm; Manufacturer: Coilcraft; Type: ShieldedPowerInductor; Package Reference: LPS3015; Mounting Style: SMD/SMT; RoHS: True; Tolerance: 20%; Product Category: FixedInductors; Datasheet Version: 09/2015; Manufacturer URL: http://www.coilcraft.com/; Packaging: CutTape; Operating Temperature Range: -40Cto+85C; Factory Pack Quantity: 1; Mounting Technology: SurfaceMount; Product: PowerInductors; Package Description: 2-Pin Surfave Mount Device, Body 2.95 x 2.95 mm; Shielding: Shielded
L7 = CMP-0226-00134-1: SMD Flat Wire High Current Inductor WE-HCI, L=1.80 µH; Inductance: 1.80 ÂµH; PackageVersion: 2008; ComponentLink1Description: Manufacturer Link; PackageReference: WE-HCI-1050; ComponentLink1URL: http://www.we-online.com; ComponentLink2URL: http://www.we-online.de/katalog/media/pdf/744325180.pdf; DatasheetVersion: ver 2, Jan-2008; PackageDescription: SMD Inductor, 2-Leads, Body 10.5 x 10.2 mm; ComponentLink2Description: Datasheet
Q2 = CMP-2000-05778-1: P-Channel MOSFET, 30 V, 4 A, -55 to 150 degC, 3-Pin SOT-23-3L, RoHS, Tape and Reel; Manufacturer: Alpha and Omega; Output Power (Max): NotRequiredW; Power Dissipation: 1.4W; Rad Hardened: No; Drain Efficiency: NotRequired%; Drain-Source On-Volt: 30V; Noise Figure: NotRequireddB; Frequency (Max): NotRequiredMHz; Number of  Elements: 1; Gate-Source Voltage (Max): ?12V; Drain Current (Max): 4A; Channel Mode: Enhancement; Drain-Source On-Res: 0.044ohm; Type: PowerMOSFET; Polarity: P; Package URL: http://www.aosmd.com/res/packaging_information/SOT-23-3L.pdf; Datasheet URL: http://www.aosmd.com/res/data_sheets/AO3401A.pdf; Package Type: SOT-23; Package Description: 3-Pin Small Outline Transistor, Body 2.95 x 1.6 mm, Pitch 0.95 mm; Mounting: SurfaceMount; Manufacturer URL: http://www.aosmd.com/; Continuous Drain Current: 4A; Package Reference: SOT-23-3L; Mounting Technology: SurfaceMount; Operating Temperature Classification: Military; Power Gain: NotRequireddB; Datasheet Version: Rev. 3, 03/2011; Operating Temp Range: -55Cto150C; Pin Count: 3
R26-R28 R30-R43 = RES: Resistor; Value: 1K; Published: 8-Jun-2000; Revision: July-2002: Re-released for DXP Platform.; Publisher: Altium Limited
R29 = RES: Resistor; Published: 8-Jun-2000; Revision: July-2002: Re-released for DXP Platform.; Publisher: Altium Limited; Value: 1K
U6 U9 = CMP-0323-00361-1: Buck Step Down Regulator with 2.3 to 6 V Input and 0.6 to 6 V Output, -40 to 85 degC, 6-Pin SON (DRV), Green (RoHS & no Sb/Br); Manufacturer: Texas Instruments; Iout(Max)(A): 1; Vout(Min)(V): 0.6; Synchronous Rectification: TRUE; Rating: Catalog; Vin(Max)(V): 6; Duty Cycle(Max)(%): 100; Switch Current Limit(Typ)(A): 1.4; Vin(Min)(V): 2.3; SubFamily: Step-Down Regulator; Iq(Typ)(mA): 0.015; ComponentLink1URL: http://www.ti.com/general/docs/lit/getliterature.tsp?genericPartNumber=TPS62290&fileType=pdf; Topology: Buck; PackageVersion: revE, Oct-2010; Eco-Plan: Green (RoHS & no Sb/Br); Mounting Technology: Surface Mount; PartNumber: TPS62290DRVR; Regulated Outputs(#): 1; Vout(Max)(V): 6; ComponentLink2URL: Samples URL:http://www.ti.com/product/tps62290#samples; DatasheetVersion: SLVS764C; ComponentLink1Description: Datasheet; PackageReference: DRV6-1600X1000TP; PackageDescription: 6-Pin Plastic Small Outline No-Lead, 2 x 2 x 0.8 mm Body, 0.65 mm Pitch, Exposed Pad; ComponentLink2Description: URL Link1
U7 = TPS54020RUWR: Manufacturer Name: Texas Instruments; Manufacturer Part Number: TPS54020RUWR; Value: N/A; PackageReference: TPS54020RUWR
U8 = IMP809: Power Monitor

## Nets that join several sheets
1_1V: TUSB8041_Misc_2 (FB6.2), TUSB8041_Power_Logic_2 (5 pins)
3_3V: TUSB8041_Connectors_2 (R1.1 R2.1 R5.1 R6.1), TUSB8041_Misc_2 (13 pins), TUSB8041_Power_Logic_2 (8 pins)
5VBus: TUSB8041_Connectors_2 (C32.2 FB4.2), TUSB8041_Power_Logic_2 (Q2.2 R37.1)
GND: TUSB8041_Connectors_2 (59 pins), TUSB8041_Misc_2 (26 pins), TUSB8041_Power_Logic_2 (44 pins)
P5V: TUSB8041_Connectors_2 (12 pins), TUSB8041_Power_Logic_2 (14 pins)
SHIELD: TUSB8041_Connectors_2 (18 pins), TUSB8041_Power_Logic_2 (C69.1 R40.2)
OVCUR1: TUSB8041_Connectors_2 (R1.2 U1.5), TUSB8041_Misc_2 (U5.46)
OVCUR2: TUSB8041_Connectors_2 (R5.2 U3.5), TUSB8041_Misc_2 (U5.47)
OVCUR3: TUSB8041_Connectors_2 (R2.2 U2.5), TUSB8041_Misc_2 (U5.44)
OVCUR4: TUSB8041_Connectors_2 (R6.2 U4.5), TUSB8041_Misc_2 (U5.43)
PWREN1: TUSB8041_Connectors_2 (U1.4), TUSB8041_Misc_2 (J7.1 R10.1)
PWREN2: TUSB8041_Connectors_2 (U3.4), TUSB8041_Misc_2 (J9.1 R11.1)
PWREN3: TUSB8041_Connectors_2 (U2.4), TUSB8041_Misc_2 (J13.1 R12.1)
PWREN4: TUSB8041_Connectors_2 (U4.4), TUSB8041_Misc_2 (J14.1 R13.1)
RST_OUT: TUSB8041_Misc_2 (U5.50), TUSB8041_Power_Logic_2 (C68.2 R36.2 R38.1 U8.2)
SSRX0_A_N: TUSB8041_Connectors_2 (D8.5 D8.6 J4.9), TUSB8041_Misc_2 (U5.59)
SSRX0_A_P: TUSB8041_Connectors_2 (D8.4 D8.7 J4.8), TUSB8041_Misc_2 (U5.58)
SSRX1_A_N: TUSB8041_Connectors_2 (D1.1 D1.9 J1.5), TUSB8041_Misc_2 (U5.7)
SSRX1_A_P: TUSB8041_Connectors_2 (D1.2 D1.8 J1.6), TUSB8041_Misc_2 (U5.6)
SSRX2_A_N: TUSB8041_Connectors_2 (D4.1 D4.9 J2.5), TUSB8041_Misc_2 (U5.15)
SSRX2_A_P: TUSB8041_Connectors_2 (D4.2 D4.8 J2.6), TUSB8041_Misc_2 (U5.14)
SSRX3_A_N: TUSB8041_Connectors_2 (D7.1 D7.9 J3.5), TUSB8041_Misc_2 (U5.23)
SSRX3_A_P: TUSB8041_Connectors_2 (D7.2 D7.8 J3.6), TUSB8041_Misc_2 (U5.22)
SSRX4_A_N: TUSB8041_Connectors_2 (D11.1 D11.9 J5.5), TUSB8041_Misc_2 (U5.30)
SSRX4_A_P: TUSB8041_Connectors_2 (D11.2 D11.8 J5.6), TUSB8041_Misc_2 (U5.29)
SSTX0_N: TUSB8041_Connectors_2 (C23.1), TUSB8041_Misc_2 (U5.56)
SSTX0_P: TUSB8041_Connectors_2 (C24.1), TUSB8041_Misc_2 (U5.55)
SSTX1_N: TUSB8041_Connectors_2 (C2.1), TUSB8041_Misc_2 (U5.4)
SSTX1_P: TUSB8041_Connectors_2 (C1.1), TUSB8041_Misc_2 (U5.3)
SSTX2_N: TUSB8041_Connectors_2 (C14.1), TUSB8041_Misc_2 (U5.12)
SSTX2_P: TUSB8041_Connectors_2 (C13.1), TUSB8041_Misc_2 (U5.11)
SSTX3_N: TUSB8041_Connectors_2 (C22.1), TUSB8041_Misc_2 (U5.20)
SSTX3_P: TUSB8041_Connectors_2 (C21.1), TUSB8041_Misc_2 (U5.19)
SSTX4_N: TUSB8041_Connectors_2 (C30.1), TUSB8041_Misc_2 (U5.27)
SSTX4_P: TUSB8041_Connectors_2 (C29.1), TUSB8041_Misc_2 (U5.26)
USBDP_N: TUSB8041_Connectors_2 (L4.3), TUSB8041_Misc_2 (U5.54)
USBDP_P: TUSB8041_Connectors_2 (L4.4), TUSB8041_Misc_2 (U5.53)
USBHP1_N: TUSB8041_Connectors_2 (L1.3), TUSB8041_Misc_2 (U5.2)
USBHP1_P: TUSB8041_Connectors_2 (L1.4), TUSB8041_Misc_2 (U5.1)
USBHP2_N: TUSB8041_Connectors_2 (L2.3), TUSB8041_Misc_2 (U5.10)
USBHP2_P: TUSB8041_Connectors_2 (L2.4), TUSB8041_Misc_2 (U5.9)
USBHP3_N: TUSB8041_Connectors_2 (L3.3), TUSB8041_Misc_2 (U5.18)
USBHP3_P: TUSB8041_Connectors_2 (L3.4), TUSB8041_Misc_2 (U5.17)
USBHP4_N: TUSB8041_Connectors_2 (L5.3), TUSB8041_Misc_2 (U5.25)
USBHP4_P: TUSB8041_Connectors_2 (L5.4), TUSB8041_Misc_2 (U5.24)
VBUSDET: TUSB8041_Misc_2 (U5.48), TUSB8041_Power_Logic_2 (R37.2 R39.1)